# Altium schematic sheet 11.Current sampling.SchDoc
size 297 x 209 mm
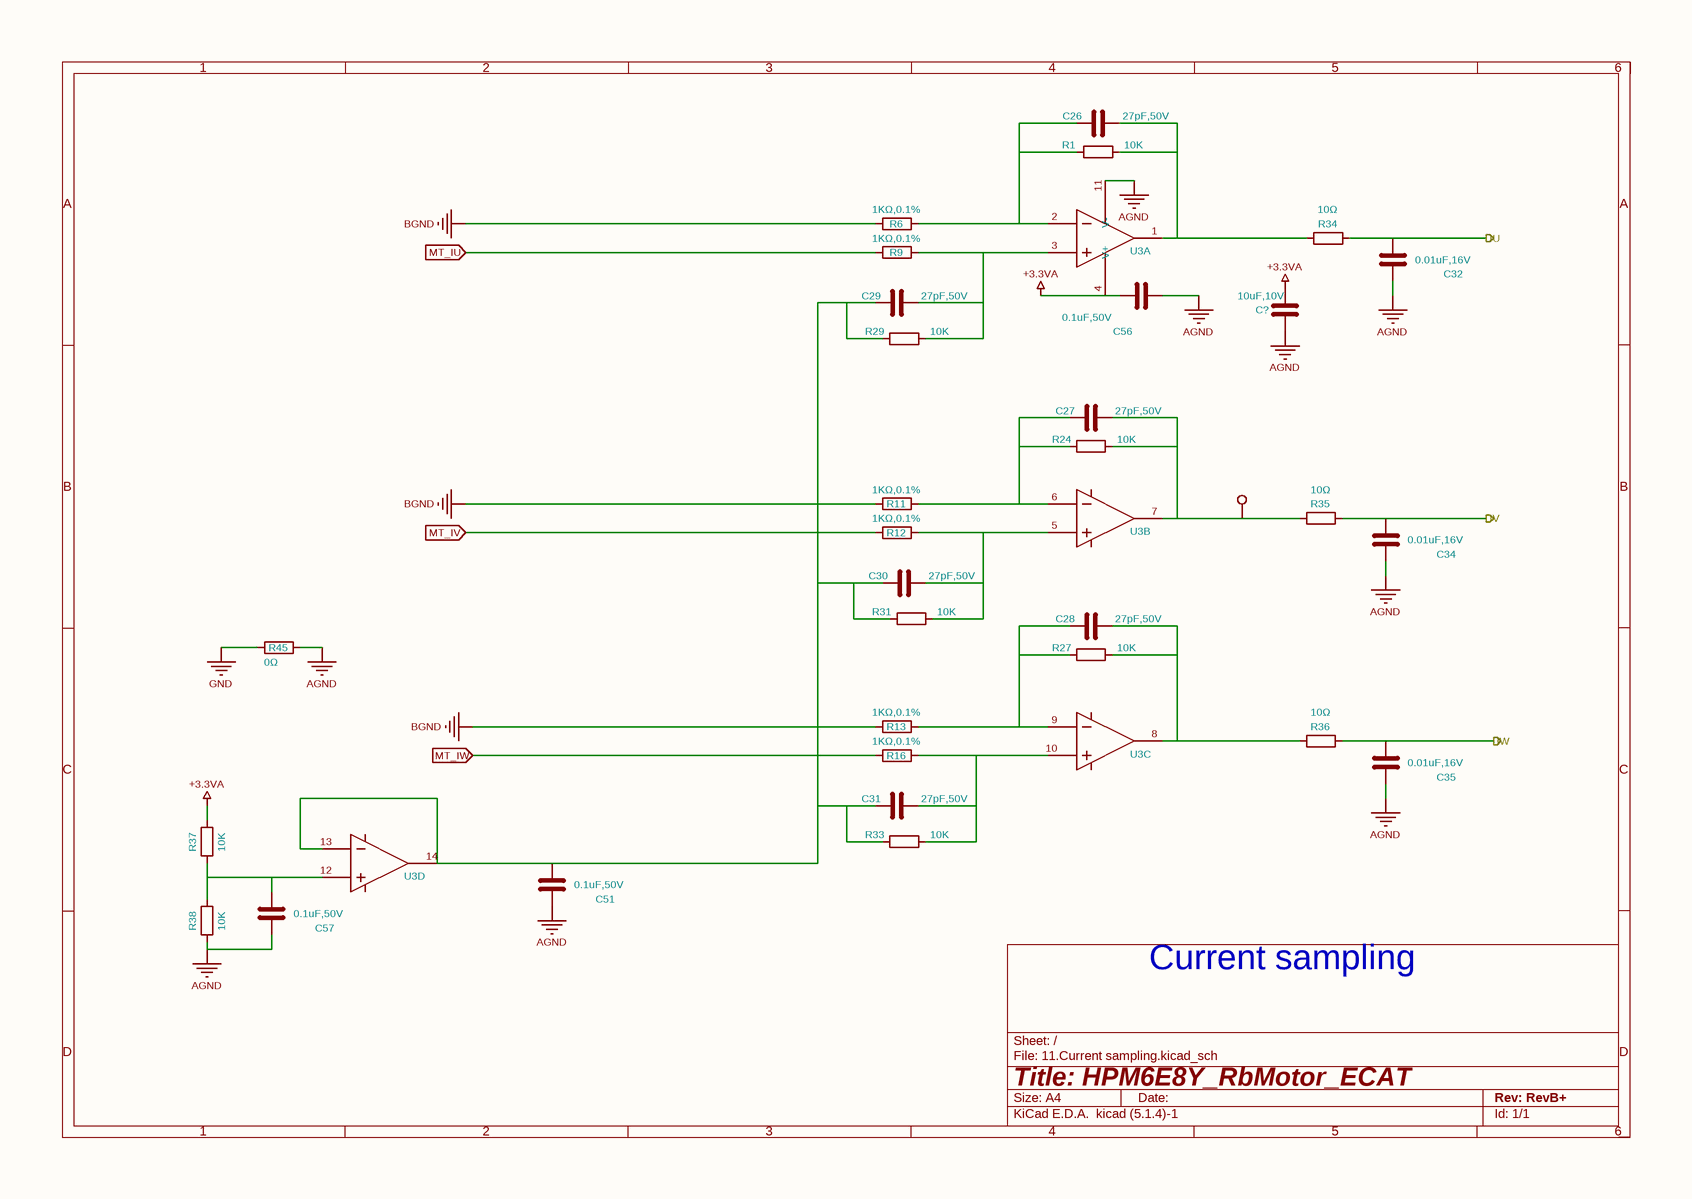
[diagram p0: 11.Current sampling.SchDoc]

## Parts
C26  27pF,50V  [C_0402]
C27  27pF,50V  [C_0402]
C28  27pF,50V  [C_0402]
C29  27pF,50V  [C_0402]
C30  27pF,50V  [C_0402]
C31  27pF,50V  [C_0402]
C32  0.01uF,16V  [C_0402_1005Metric]
C34  0.01uF,16V  [C_0402_1005Metric]
C35  0.01uF,16V  [C_0402_1005Metric]
C51  0.1uF,50V  [C_0402_1005Metric]
C56  0.1uF,50V  [C_0402_1005Metric]
C57  0.1uF,50V  [C_0402_1005Metric]
C?  10uF,10V  [C_0402]
R1  10K  [R_0402_1005Metric]
R6  1KΩ,0.1%  [R_0402_1005Metric]
R9  1KΩ,0.1%  [R_0402_1005Metric]
R11  1KΩ,0.1%  [R_0402_1005Metric]
R12  1KΩ,0.1%  [R_0402_1005Metric]
R13  1KΩ,0.1%  [R_0402_1005Metric]
R16  1KΩ,0.1%  [R_0402_1005Metric]
R24  10K  [R_0402_1005Metric]
R27  10K  [R_0402_1005Metric]
R29  10K  [R_0402_1005Metric]
R31  10K  [R_0402_1005Metric]
R33  10K  [R_0402_1005Metric]
R34  10Ω  [R_0402_1005Metric]
R35  10Ω  [R_0402_1005Metric]
R36  10Ω  [R_0402_1005Metric]
R37  10K  [R_0402_1005Metric]
R38  10K  [R_0402_1005Metric]
R45  0Ω  [R_0603_1608Metric]
TP14  0.5mm  [TestPoint_Pad_D0.5mm]  (value not drawn)
U3  TP2274-SR  [SOIC-14_L8.7-W3.9]  (value not drawn)  (parts A,B,C,D of 4)

## Ports
IU (out), IV (out), IW (out), MT_IU (in), MT_IV (in), MT_IW (in)

## Nets
+3.3VA: C56.2 C?.2 R37.2 U3.4(V+)
AGND: C32.2 C34.2 C35.2 C51.2 C56.1 C57.2 C?.1 R38.1 R45.1 U3.11(V-)
BGND: R6.1 R11.1 R13.1
GND: R45.2
IU: C32.1 R34.2 ; port IU
IV: C34.1 R35.2 ; port IV
IW: C35.1 R36.2 ; port IW
MT_IU: R9.1 ; port MT_IU
MT_IV: R12.1 ; port MT_IV
MT_IW: R16.1 ; port MT_IW
NetC26_1: C26.1 R1.1 R6.2 U3.2
NetC26_2: C26.2 R1.2 R34.1 U3.1
NetC27_1: C27.1 R11.2 R24.1 U3.6
NetC27_2: C27.2 R24.2 R35.1 TP14.1 U3.7
NetC28_1: C28.1 R13.2 R27.1 U3.9
NetC28_2: C28.2 R27.2 R36.1 U3.8
NetC29_1: C29.1 C30.1 C31.1 C51.1 R29.1 R31.1 R33.1 U3.13 U3.14
NetC29_2: C29.2 R9.2 R29.2 U3.3
NetC30_2: C30.2 R12.2 R31.2 U3.5
NetC31_2: C31.2 R16.2 R33.2 U3.10
NetC57_1: C57.1 R37.1 R38.2 U3.12

## Notes on the sheet
- Current sampling
- 1
- 2
- 3
- 4
- 5
- 6
- A
- B
- C
- D
- Title: HPM6E8Y_RbMotor_ECAT
- File: 11.Current sampling.kicad_sch
- Sheet: /
- KiCad E.D.A.  kicad (5.1.4)-1
- Size: A4
- Date:
- Rev: RevB+
- Id: 1/1

## Library data of the parts
C26-C31 = 27pF,50V_0402: Model: 0402CG270J500NT; Company: FH(风华); Value: 27pF,50V; Footprint: 03_HPM_Capacitance:C_0402
C32 C34 C35 = 10nF,16V_0402: Model: CC0402KRX7R7BB103; Company: YAGEO(国巨); Value: 0.01uF,16V; Footprint: 03_HPM_Capacitance:C_0402_1005Metric
C51 C56 C57 = 0.1uF,50V_0402: Model: 0402B104K500NT; Company: SAMSUNG(三星); Value: 0.1uF,50V; Footprint: 03_HPM_Capacitance:C_0402_1005Metric
C? = 10uF,10V_0402: Model: CL05A106MP5NUNC; Company: SAMSUNG(三星); Value: 10uF,10V; Footprint: 03_HPM_Capacitance:C_0402
R1 R24 R27 R29 R31 R33 R37 R38 = 10K_0402: Model: 0402WGF1002TCE; Company: UNI-ROYAL(厚声); Value: 10K; Footprint: 02_HPM_Resistor:R_0402_1005Metric
R6 R9 R11-R13 R16 = 1K_0402: Company: UNI-ROYAL(厚声); Value: 1KΩ,0.1%; Footprint: 02_HPM_Resistor:R_0402_1005Metric
R34-R36 = 10Ω_0402: Model: 0402WGF100JTCE; Company: UNI-ROYAL(厚声); Value: 10Ω; Footprint: 02_HPM_Resistor:R_0402_1005Metric
R45 = 0Ω_0603: Model: 0603WAF0000T5E; Company: UNI-ROYAL(厚声); Value: 0Ω; Footprint: 02_HPM_Resistor:R_0603_1608Metric
TP14 = TestPoint-0.5mm: Value: 0.5mm; Footprint: 01_HPM_Peripheral:TestPoint_Pad_D0.5mm
U3 = TP2274-SR: Company: 3PEAK(思瑞浦); Model: TP2274-SR; Value: TP2274-SR; Footprint: 13_ower:SOIC-14_L8.7-W3.9